# EAGLE design elric20-01B (EAGLE 9.5.2)
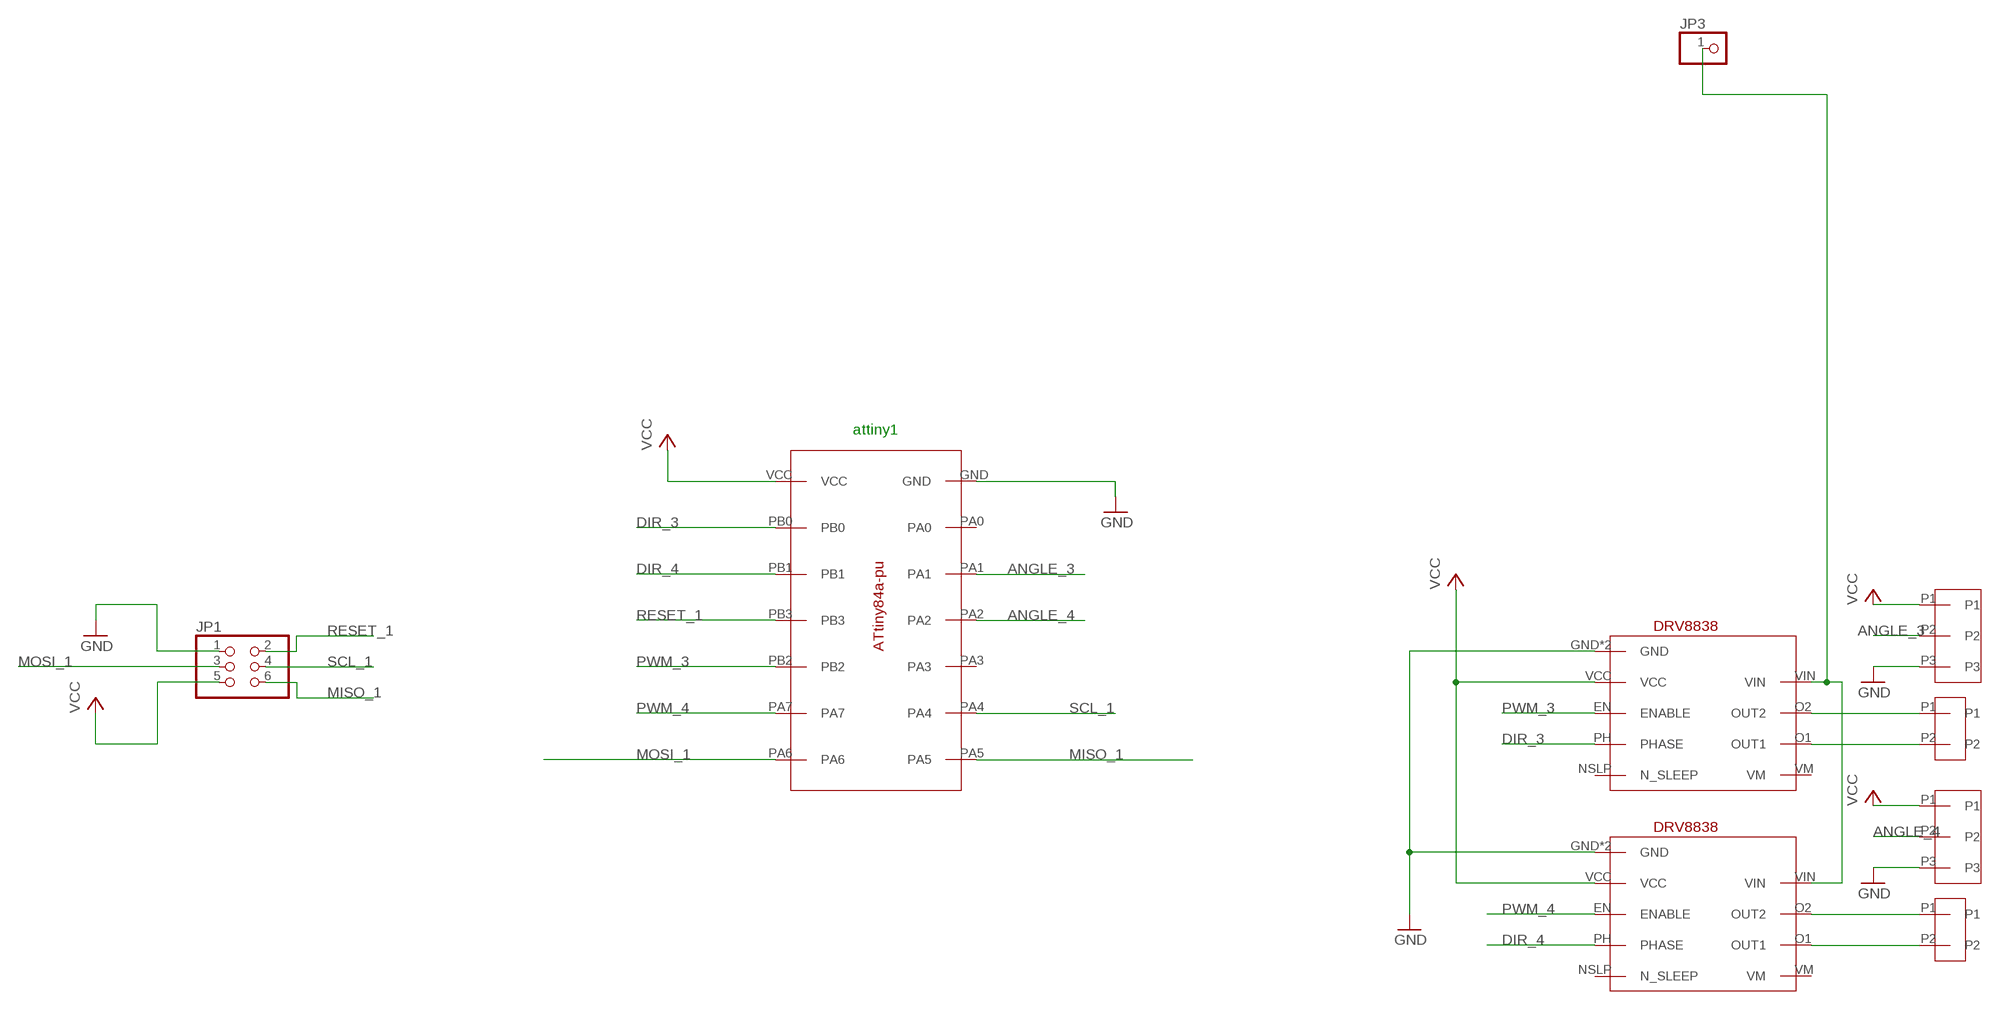
[diagram p0: schematic, sheet 1]

## Parts
JP1  PINHD-2X3  [2X03]
JP3  PINHD-1X1  [1X01]
U$4  DRV8838  [DRV8838]
U$5  DRV8838  [DRV8838]
U$8  ATTINY84A-PU  [ATTINY84A-PU]
U$11  PAD_SMD_X2_BIG  [PAD_SMD_X2_BIG]
U$12  PAD_SMD_X2_BIG  [PAD_SMD_X2_BIG]
U$17  PAD_SMD_X3  [PAD_SMD_X3]
U$18  PAD_SMD_X3  [PAD_SMD_X3]

## Nets
ANGLE_3: U$8.PA1 U$18.P2
ANGLE_4: U$8.PA2 U$17.P2
DIR_3: U$4.PH(PHASE) U$8.PB0
DIR_4: U$5.PH(PHASE) U$8.PB1
GND: JP1.1 U$4.GND U$4.GND2(GND) U$5.GND U$5.GND2(GND) U$8.GND U$17.P3 U$18.P3
MISO_1: JP1.6 U$8.PA5
MOSI_1: JP1.3 U$8.PA6
N$2: JP3.1 U$4.VIN U$5.VIN
N$5: U$4.O2(OUT2) U$11.P1
N$6: U$4.O1(OUT1) U$11.P2
N$7: U$5.O2(OUT2) U$12.P1
N$8: U$5.O1(OUT1) U$12.P2
PWM_3: U$4.EN(ENABLE) U$8.PB2
PWM_4: U$5.EN(ENABLE) U$8.PA7
RESET_1: JP1.2 U$8.PB3
SCL_1: JP1.4 U$8.PA4
VCC: JP1.5 U$4.VCC U$5.VCC U$8.VCC U$17.P1 U$18.P1
Unconnected: U$4.NSLP(N_SLEEP) U$4.VM U$5.NSLP(N_SLEEP) U$5.VM U$8.PA0 U$8.PA3

## Notes on the sheet
- attiny1

## Library data of the parts
JP1 = pinhead:PINHD-2X3: PIN HEADER
JP3 = pinhead:PINHD-1X1: PIN HEADER
U$4 U$5 = elric:DRV8838
U$8 = elric:ATTINY84A-PU
U$11 U$12 = elric:PAD_SMD_X2_BIG
U$17 U$18 = elric:PAD_SMD_X3

## Board
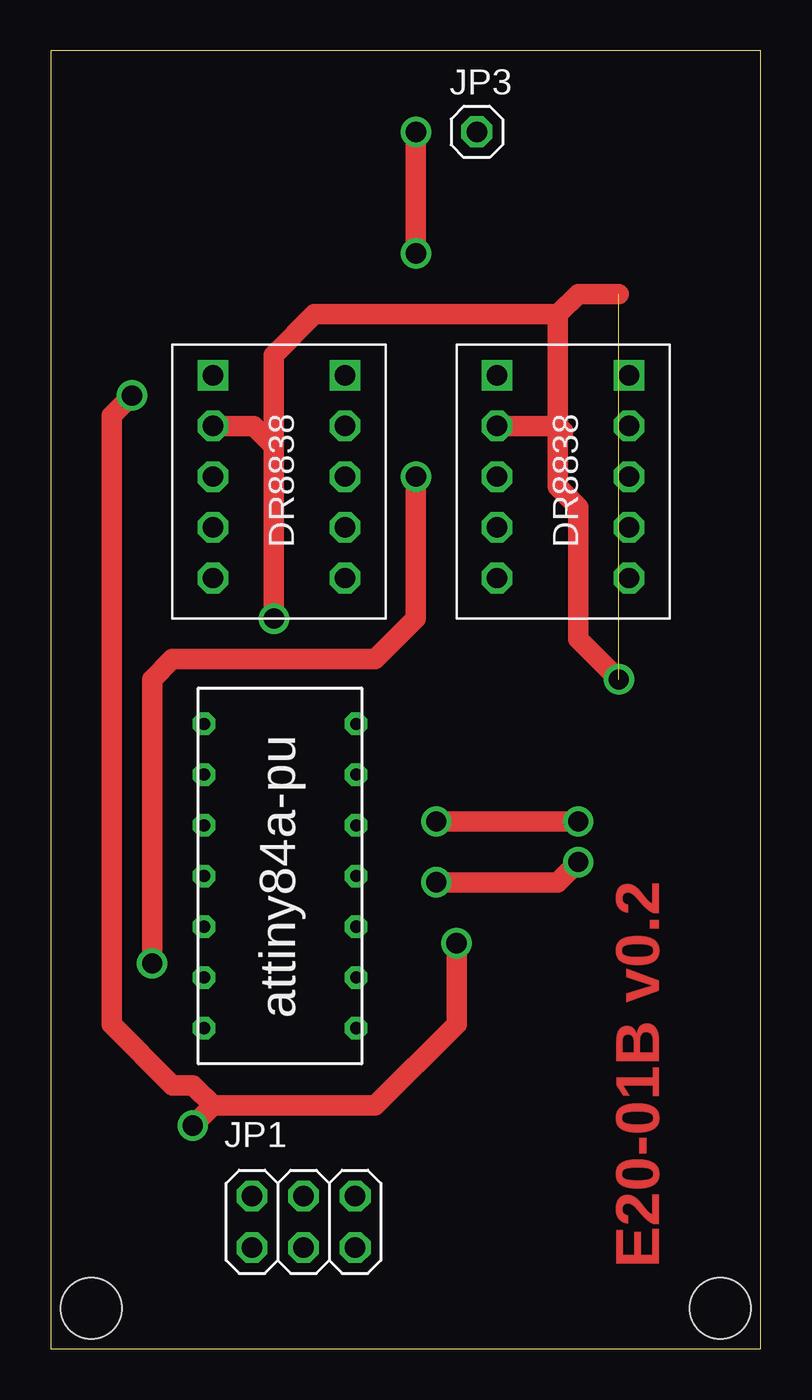
[diagram p1: board, top side]
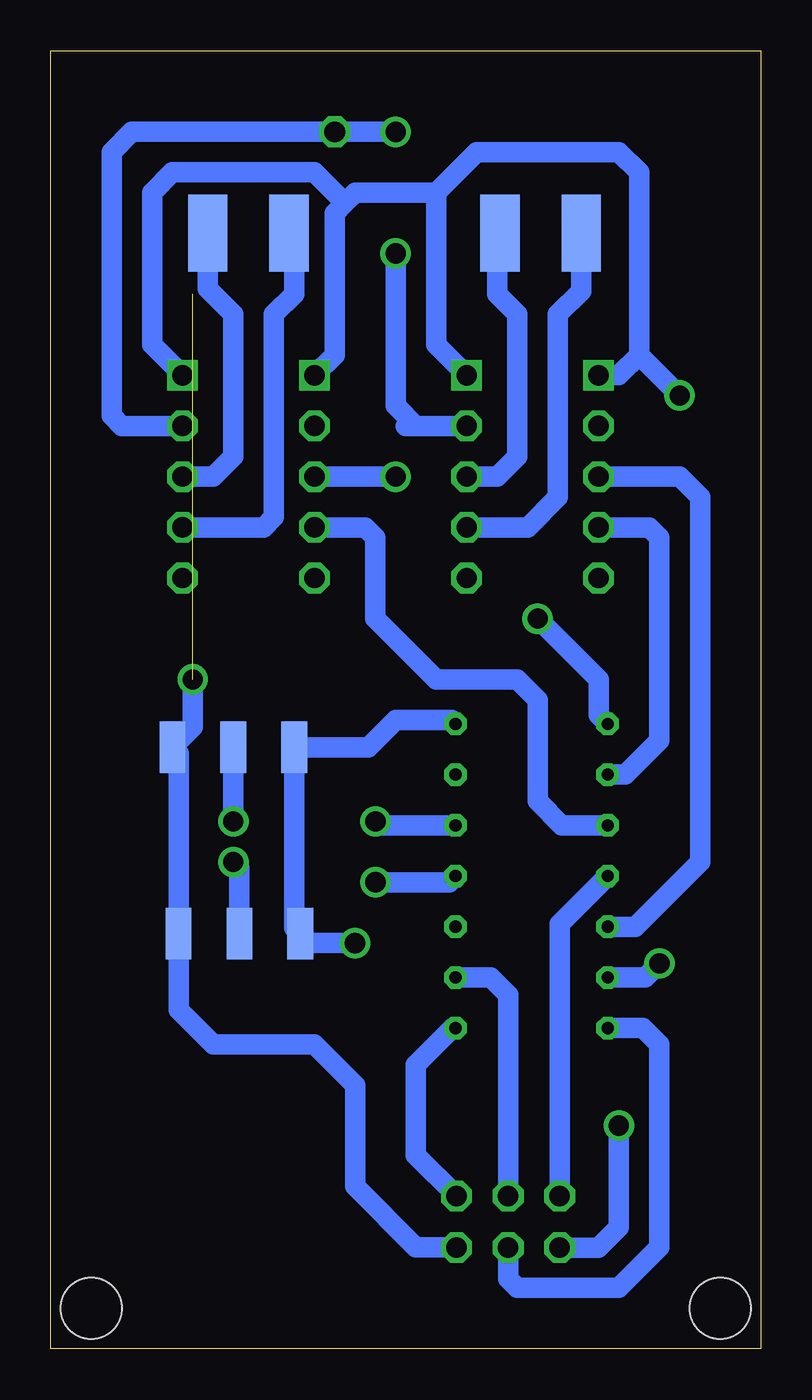
[diagram p2: board, bottom side, seen from below]

Size 35 x 64 mm. Coordinates in mm from the lower left corner, seen from the top.
Outline: 0,0 35,0 35,64 0,64 0,0
Copper layers (1*16): Top 0.035mm / dielectric 1.5mm / Bottom 0.035mm
Design rules "default": minimum track width 6mil, minimum drill 0.35mm, track to track 6mil, track to pad 6mil, pad to pad 6mil, via to via 6mil, smd to smd 6mil, copper to edge 40mil, drill to drill 6mil, minimum pad ring 10mil, minimum via ring 8mil, stop-mask expansion 4mil, vias tented up to drill 0mil, thermal gap 10mil
Holes 3 mm at 2,2 33,2

### Footprints (pad centres in the part's own frame; a part is rotated, then mirrored left to right if it is on the bottom)
2X03 = drill 1.016 octagon: 1 -2.54,-1.27; 2 -2.54,1.27; 3 0,-1.27; 4 0,1.27; 5 2.54,-1.27; 6 2.54,1.27
1X01 = drill 1.016 octagon: 1 0,0
DRV8838 = drill 1 octagon: EN 0,-5; NSLP 0,-10; O1 6.5,-7.5; O2 6.5,-5; PH 0,-7.5; VCC 0,-2.5; VIN 6.5,-2.5; VM 6.5,-10 | drill 1 square: GND 0,0; GND2 6.5,0
ATTINY84A-PU = drill 0.6 octagon: GND 7.5,0; PA0 7.5,-2.5; PA1 7.5,-5; PA2 7.5,-7.5; PA3 7.5,-10; PA4 7.5,-12.5; PA5 7.5,-15; PA6 0,-15; PA7 0,-12.5; PB0 0,-2.5; PB1 0,-5; PB2 0,-10; PB3 0,-7.5; VCC 0,0
PAD_SMD_X2_BIG = smd 3.81 x 1.93: P1 0,4; P2 0,0
PAD_SMD_X3 = smd 2.54 x 1.27: P1 0,3; P2 0,0; P3 0,-3

### Placement (x,y rotation side)
JP1  12.46,6.26 0 top
JP3  21,60 0 top
U$4  8,48 0 top
U$5  22,48 0 top
U$8  7.55,30.81 0 top
U$11  8.86,55 90 bottom
U$12  23.26,55 90 bottom
U$17  25.7,20.46 90 bottom
U$18  26,29.65 90 bottom

### Tracks (layer width: path | path; a pad name or v marks a point on that pad's centre or on a via)
ANGLE_3  (via drill 1)
  Top 1.016: v26,26 v19,26
  Bottom 1.016: U$18.P2 v26,26 | v19,26 18.81,25.81 U$8.PA1
ANGLE_4  (via drill 1)
  Top 1.016: v26,24 25,23 v19,23
  Bottom 1.016: U$17.P2 25.7,23.7 v26,24 | v19,23 15.36,23 U$8.PA2
DIR_3
  Bottom 1.016: U$4.PH 5.5,40.5 5,40 5,30 6.69,28.31 U$8.PB0
DIR_4
  Bottom 1.016: U$5.PH 19.5,40.5 19,40 19,36 16,33 12,33 11,32 11,27 9.81,25.81 U$8.PB1
GND  (via drill 1)
  Top 1.016: v7,11 8,12 | 8,12 16,12 20,16 v20,20 | v4,47 3,46 3,16 6,13 7,13 8,12
  Bottom 1.016: U$8.GND 15.24,31 18,31 19.35,29.65 U$18.P3 23,20.76 U$17.P3 22.24,20 v20,20 | 6,49 6,58 7,59 14,59 16,57 | 6,49 7,48 U$4.GND | 16,57 16,49.5 U$4.GND2 | 16,57 20,57 20.5,56.5 | 20.5,56.5 21,56 21,49 U$5.GND | 20.5,56.5 22,58 29,58 30,57 30,49.5 U$5.GND2 | JP1.1 8.01,4.99 7,6 v7,11 | 6,49 v4,47
MISO_1
  Bottom 1.016: JP1.6 17,9.53 17,14 15.19,15.81 U$8.PA5
MOSI_1
  Bottom 1.016: U$8.PA6 5.81,15.81 5,15 5,5 7,3 12,3 12.46,3.46 JP1.3
N$2  (via drill 1)
  Top 1.016: v18,54 v18,60
  Bottom 1.016: U$4.VIN 17,45.5 | 17,45.5 17.5,45.5 | 17,45.5 18,46.5 v18,54 | v18,60 JP3.1 31,60 32,59 32,46 31.5,45.5 U$5.VIN
N$5
  Bottom 1.016: U$4.O2 13,43 12,44 12,51 13,52 13,54.86 U$11.P1
N$6
  Bottom 1.016: U$4.O1 11.5,40.5 10,42 10,51 8.86,52.14 U$11.P2
N$7
  Bottom 1.016: U$5.O2 27,43 26,44 26,51 27.26,52.26 U$12.P1
N$8
  Bottom 1.016: U$5.O1 24.5,40.5 24,41 24,51 23,52 23,54.74 U$12.P2
PWM_3
  Bottom 1.016: U$4.EN 4,43 3,42 3,24 6.19,20.81 U$8.PB2
PWM_4  (via drill 1)
  Top 1.016: v18,43 18,36 16,34 6,34 5,33 v5,19
  Bottom 1.016: U$5.EN v18,43 | U$8.PA7 5.69,18.31 v5,19
RESET_1
  Bottom 1.016: JP1.2 9.92,20.94 U$8.PB3
SCL_1
  Bottom 1.016: JP1.4 12.46,17.46 13.31,18.31 U$8.PA4
VCC  (via drill 1)  (1 unrouted)
  Top 1.016: 11,44.5 10,45.5 U$4.VCC | v28,33 26,35 26,41.5 25,42.5 25,51 | 25.25,45.25 25,45.5 U$5.VCC | 25,51 26,52 28,52 | 25,51 13,51 11,49 11,44.5 | v11,36 11,44.5
  Bottom 1.016: JP1.5 17,5 20,8 20,13 22,15 27,15 28.7,16.7 U$17.P1 28.7,29.35 U$18.P1 28,30.65 v28,33 | U$8.VCC 8,31.26 8,33 v11,36

### Text on the board
Top: E20-01B v0.2